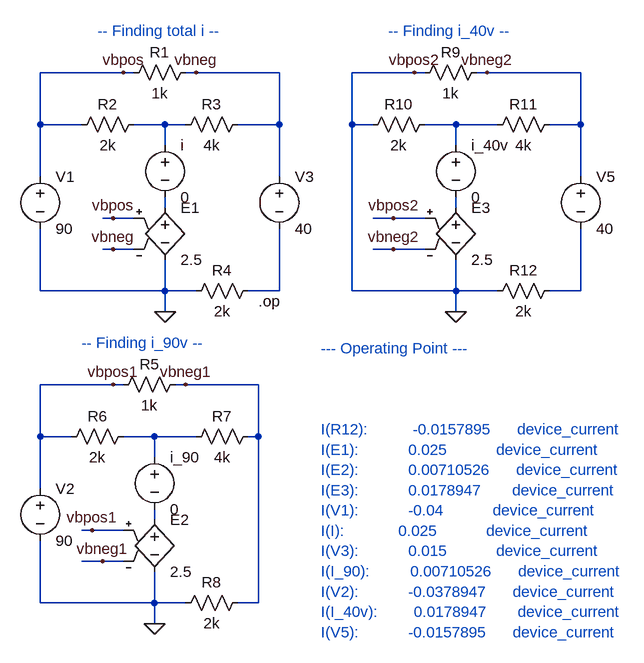
[diagram p0: schematic Q4.asc]
Q4.asc, the LTspice schematic file:
Version 4
SHEET 1 1320 1036
WIRE 144 64 16 64
WIRE 160 64 144 64
WIRE 256 64 240 64
WIRE 384 64 256 64
WIRE 592 64 496 64
WIRE 608 64 592 64
WIRE 704 64 688 64
WIRE 848 64 704 64
WIRE 16 144 16 64
WIRE 80 144 16 144
WIRE 208 144 160 144
WIRE 240 144 208 144
WIRE 384 144 384 64
WIRE 384 144 320 144
WIRE 496 144 496 64
WIRE 528 144 496 144
WIRE 656 144 608 144
WIRE 720 144 656 144
WIRE 848 144 848 64
WIRE 848 144 800 144
WIRE 208 176 208 144
WIRE 656 176 656 144
WIRE 16 224 16 144
WIRE 384 224 384 144
WIRE 848 224 848 144
WIRE 208 272 208 256
WIRE 656 272 656 256
WIRE 128 288 112 288
WIRE 160 288 128 288
WIRE 560 288 528 288
WIRE 608 288 560 288
WIRE 128 336 112 336
WIRE 160 336 128 336
WIRE 560 336 528 336
WIRE 608 336 560 336
WIRE 16 400 16 304
WIRE 208 400 208 352
WIRE 208 400 16 400
WIRE 256 400 208 400
WIRE 384 400 384 304
WIRE 384 400 336 400
WIRE 496 400 496 144
WIRE 656 400 656 352
WIRE 656 400 496 400
WIRE 720 400 656 400
WIRE 848 400 848 304
WIRE 848 400 800 400
WIRE 208 432 208 400
WIRE 656 432 656 400
WIRE 128 544 16 544
WIRE 144 544 128 544
WIRE 240 544 224 544
WIRE 352 544 240 544
WIRE 16 624 16 544
WIRE 64 624 16 624
WIRE 192 624 144 624
WIRE 256 624 192 624
WIRE 352 624 352 544
WIRE 352 624 336 624
WIRE 192 656 192 624
WIRE 16 704 16 624
WIRE 192 752 192 736
WIRE 96 768 80 768
WIRE 144 768 96 768
WIRE 112 816 80 816
WIRE 144 816 112 816
WIRE 16 880 16 784
WIRE 192 880 192 832
WIRE 192 880 16 880
WIRE 240 880 192 880
WIRE 352 880 352 624
WIRE 352 880 320 880
WIRE 192 912 192 880
FLAG 208 432 0
FLAG 144 64 vbpos
FLAG 256 64 vbneg
FLAG 128 336 vbneg
FLAG 128 288 vbpos
FLAG 192 912 0
FLAG 128 544 vbpos1
FLAG 240 544 vbneg1
FLAG 112 816 vbneg1
FLAG 96 768 vbpos1
FLAG 656 432 0
FLAG 592 64 vbpos2
FLAG 560 288 vbpos2
FLAG 704 64 vbneg2
FLAG 560 336 vbneg2
SYMBOL res 256 48 R90
WINDOW 0 0 56 VBottom 2
WINDOW 3 32 56 VTop 2
SYMATTR InstName R1
SYMATTR Value 1k
SYMBOL res 176 128 R90
WINDOW 0 0 56 VBottom 2
WINDOW 3 32 56 VTop 2
SYMATTR InstName R2
SYMATTR Value 2k
SYMBOL res 336 128 R90
WINDOW 0 0 56 VBottom 2
WINDOW 3 32 56 VTop 2
SYMATTR InstName R3
SYMATTR Value 4k
SYMBOL voltage 16 208 R0
SYMATTR InstName V1
SYMATTR Value 90
SYMBOL voltage 208 160 R0
SYMATTR InstName i
SYMATTR Value 0
SYMBOL voltage 384 208 R0
SYMATTR InstName V3
SYMATTR Value 40
SYMBOL e 208 256 R0
SYMATTR InstName E1
SYMATTR Value 2.5
SYMBOL res 352 384 R90
WINDOW 0 0 56 VBottom 2
WINDOW 3 32 56 VTop 2
SYMATTR InstName R4
SYMATTR Value 2k
SYMBOL res 240 528 R90
WINDOW 0 0 56 VBottom 2
WINDOW 3 32 56 VTop 2
SYMATTR InstName R5
SYMATTR Value 1k
SYMBOL res 160 608 R90
WINDOW 0 0 56 VBottom 2
WINDOW 3 32 56 VTop 2
SYMATTR InstName R6
SYMATTR Value 2k
SYMBOL res 352 608 R90
WINDOW 0 0 56 VBottom 2
WINDOW 3 32 56 VTop 2
SYMATTR InstName R7
SYMATTR Value 4k
SYMBOL voltage 192 640 R0
SYMATTR InstName i_90
SYMATTR Value 0
SYMBOL e 192 736 R0
SYMATTR InstName E2
SYMATTR Value 2.5
SYMBOL voltage 16 688 R0
SYMATTR InstName V2
SYMATTR Value 90
SYMBOL res 336 864 R90
WINDOW 0 0 56 VBottom 2
WINDOW 3 32 56 VTop 2
SYMATTR InstName R8
SYMATTR Value 2k
SYMBOL res 704 48 R90
WINDOW 0 0 56 VBottom 2
WINDOW 3 32 56 VTop 2
SYMATTR InstName R9
SYMATTR Value 1k
SYMBOL res 624 128 R90
WINDOW 0 0 56 VBottom 2
WINDOW 3 32 56 VTop 2
SYMATTR InstName R10
SYMATTR Value 2k
SYMBOL res 816 128 R90
WINDOW 0 0 56 VBottom 2
WINDOW 3 32 56 VTop 2
SYMATTR InstName R11
SYMATTR Value 4k
SYMBOL voltage 656 160 R0
SYMATTR InstName i_40v
SYMATTR Value 0
SYMBOL e 656 256 R0
SYMATTR InstName E3
SYMATTR Value 2.5
SYMBOL res 816 384 R90
WINDOW 0 0 56 VBottom 2
WINDOW 3 32 56 VTop 2
SYMATTR InstName R12
SYMATTR Value 2k
SYMBOL voltage 848 208 R0
SYMATTR InstName V5
SYMATTR Value 40
TEXT 352 416 Left 2 !.op
TEXT 104 0 Left 2 ;-- Finding total i --
TEXT 80 480 Left 2 ;-- Finding i_90v --
TEXT 552 0 Left 2 ;-- Finding i_40v --
TEXT 448 488 Left 2 ;--- Operating Point ---\n \n \n\nI(R12):          -0.0157895      device_current\nI(E1):           0.025           device_current\nI(E2):           0.00710526      device_current\nI(E3):           0.0178947       device_current\nI(V1):           -0.04           device_current\nI(I):            0.025           device_current\nI(V3):           0.015           device_current\nI(I_90):         0.00710526      device_current\nI(V2):           -0.0378947      device_current\nI(I_40v):        0.0178947       device_current\nI(V5):           -0.0157895      device_current

The netlist it stands for:
* Q4.asc
R1 vbneg vbpos 1k
R2 N001 vbpos 2k
R3 vbneg N001 4k
V1 vbpos 0 90
V§i N001 N003 0
V3 vbneg N005 40
E1 N003 0 vbpos vbneg 2.5
R4 N005 0 2k
R5 vbneg1 vbpos1 1k
R6 N007 vbpos1 2k
R7 vbneg1 N007 4k
V§i_90 N007 N008 0
E2 N008 0 vbpos1 vbneg1 2.5
V2 vbpos1 0 90
R8 vbneg1 0 2k
R9 vbneg2 0 1k
R10 N002 0 2k
R11 vbneg2 N002 4k
V§i_40v N002 N004 0
E3 N004 0 0 vbneg2 2.5
R12 N006 0 2k
V5 vbneg2 N006 40
.op
* -- Finding total i --
* -- Finding i_90v --
* -- Finding i_40v --
* --- Operating Point ---
* I(R12):          -0.0157895      device_current
* I(E1):           0.025           device_current
* I(E2):           0.00710526      device_current
* I(E3):           0.0178947       device_current
* I(V1):           -0.04           device_current
* I(I):            0.025           device_current
* I(V3):           0.015           device_current
* I(I_90):         0.00710526      device_current
* I(V2):           -0.0378947      device_current
* I(I_40v):        0.0178947       device_current
* I(V5):           -0.0157895      device_current
.backanno
.end